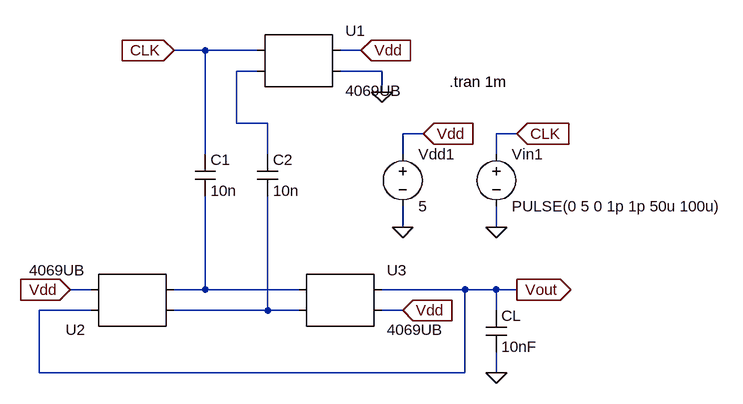
[diagram p0: schematic Q3.asc]
Q3.asc, the LTspice schematic file:
Version 4
SHEET 1 980 680
WIRE 176 96 128 96
WIRE 256 96 176 96
WIRE 416 96 384 96
WIRE 256 128 224 128
WIRE 448 128 384 128
WIRE 448 160 448 128
WIRE 224 208 224 128
WIRE 272 208 224 208
WIRE 512 224 480 224
WIRE 656 224 624 224
WIRE 176 256 176 96
WIRE 272 256 272 208
WIRE 480 256 480 224
WIRE 624 256 624 224
WIRE 480 368 480 336
WIRE 624 368 624 336
WIRE 0 464 -32 464
WIRE 176 464 176 320
WIRE 176 464 128 464
WIRE 320 464 176 464
WIRE 576 464 448 464
WIRE 624 464 576 464
WIRE 656 464 624 464
WIRE 0 496 -80 496
WIRE 272 496 272 320
WIRE 272 496 128 496
WIRE 320 496 272 496
WIRE 480 496 448 496
WIRE 624 496 624 464
WIRE -80 592 -80 496
WIRE 576 592 576 464
WIRE 576 592 -80 592
WIRE 624 592 624 560
FLAG 448 160 0
FLAG 480 368 0
FLAG 624 368 0
FLAG 512 224 Vdd
IOPIN 512 224 In
FLAG 656 224 CLK
IOPIN 656 224 In
FLAG 416 96 Vdd
IOPIN 416 96 In
FLAG 128 96 CLK
IOPIN 128 96 In
FLAG -32 464 Vdd
IOPIN -32 464 In
FLAG 480 496 Vdd
IOPIN 480 496 In
FLAG 624 592 0
FLAG 656 464 Vout
IOPIN 656 464 Out
SYMBOL voltage 624 240 R0
SYMATTR InstName Vin1
SYMATTR Value PULSE(0 5 0 1p 1p 50u 100u)
SYMBOL voltage 480 240 R0
SYMATTR InstName Vdd1
SYMATTR Value 5
SYMBOL AutoGenerated/4069UB 320 112 R0
SYMATTR InstName U1
SYMBOL cap 160 256 R0
SYMATTR InstName C1
SYMATTR Value 10n
SYMBOL cap 256 256 R0
SYMATTR InstName C2
SYMATTR Value 10n
SYMBOL AutoGenerated/4069UB 64 480 R180
SYMATTR InstName U2
SYMBOL AutoGenerated/4069UB 384 480 R0
SYMATTR InstName U3
SYMBOL cap 608 496 R0
SYMATTR InstName CL
SYMATTR Value 10nF
TEXT 552 144 Left 2 !.tran 1m

The netlist it stands for:
* Q3.asc
Vin1 CLK 0 PULSE(0 5 0 1p 1p 50u 100u)
Vdd1 Vdd 0 5
* U1: 4069UB (symbol AutoGenerated/4069UB not available, pins judged from their places): pin1=CLK pin2=N001 pin3=Vdd pin4=0
C1 CLK N002 10n
C2 N001 N003 10n
* U2: 4069UB (symbol AutoGenerated/4069UB not available, pins judged from their places): pin1=N003 pin2=N002 pin3=Vout pin4=Vdd
* U3: 4069UB (symbol AutoGenerated/4069UB not available, pins judged from their places): pin1=N002 pin2=N003 pin3=Vout pin4=Vdd
CL Vout 0 10nF
.tran 1m
.backanno
.end